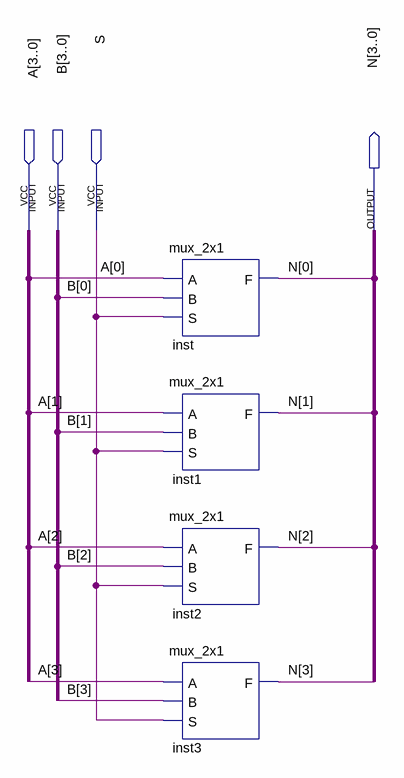
[diagram p0: schematic sheet]
// Quartus schematic mux_8x4.bdf as structural Verilog: 4 symbols, 4 pins
module mux_8x4 (
  input  [3:0] A,
  input  [3:0] B,
  input  S,
  output [3:0] N
);

  mux_2x1 inst (.A(A[0]), .B(B[0]), .S(S), .F(N[0]));
  mux_2x1 inst1 (.A(A[1]), .B(B[1]), .S(S), .F(N[1]));
  mux_2x1 inst2 (.A(A[2]), .B(B[2]), .S(S), .F(N[2]));
  mux_2x1 inst3 (.A(A[3]), .B(B[3]), .S(S), .F(N[3]));
endmodule
